# Altium schematic sheet USB-CONN.schdoc: TEBF0808 - USB Connectors
size A4; DocumentNumber: TEBF0808; Revision: 04; SheetNumber: 16; SheetTotal: 36; Date: 2016-09-29; CompanyName: Trenz Electronic GmbH; Organization: Trenz Electronic GmbH
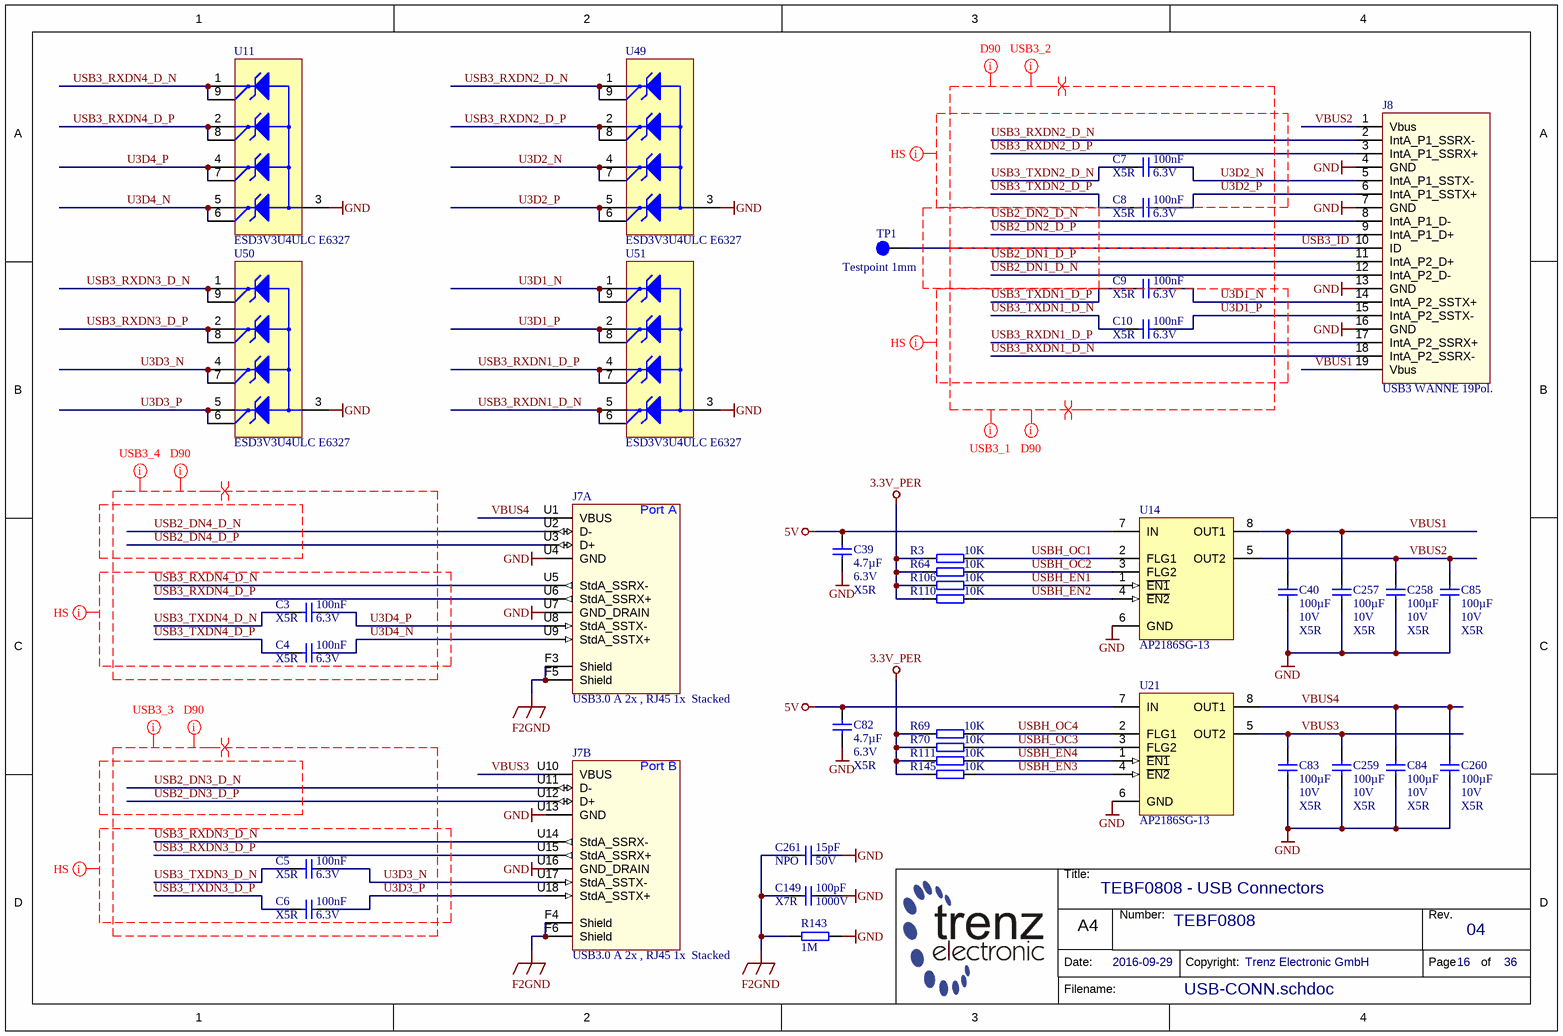
[diagram p0: USB-CONN.schdoc]

## Parts
C3  100nF  Voltage: 6.3V  Technology: X5R  [CAPC0603X33N]
C4  100nF  Voltage: 6.3V  Technology: X5R  [CAPC0603X33N]
C5  100nF  Voltage: 6.3V  Technology: X5R  [CAPC0603X33N]
C6  100nF  Voltage: 6.3V  Technology: X5R  [CAPC0603X33N]
C7  100nF  Voltage: 6.3V  Technology: X5R  [CAPC0603X33N]
C8  100nF  Voltage: 6.3V  Technology: X5R  [CAPC0603X33N]
C9  100nF  Voltage: 6.3V  Technology: X5R  [CAPC0603X33N]
C10  100nF  Voltage: 6.3V  Technology: X5R  [CAPC0603X33N]
C39  4.7µF  Voltage: 6.3V  Technology: X5R  [CAPC1005X60N]
C40  100µF  Voltage: 10V  Technology: X5R  [CAPC3216X180N]
C82  4.7µF  Voltage: 6.3V  Technology: X5R  [CAPC1005X60N]
C83  100µF  Voltage: 10V  Technology: X5R  [CAPC3216X180N]
C84  100µF  Voltage: 10V  Technology: X5R  [CAPC3216X180N]
C85  100µF  Voltage: 10V  Technology: X5R  [CAPC3216X180N]
C149  100pF  Voltage: X7R  Technology: 1000V  [CAPC3216X180N]
C257  100µF  Voltage: 10V  Technology: X5R  [CAPC3216X180N]
C258  100µF  Voltage: 10V  Technology: X5R  [CAPC3216X180N]
C259  100µF  Voltage: 10V  Technology: X5R  [CAPC3216X180N]
C260  100µF  Voltage: 10V  Technology: X5R  [CAPC3216X180N]
C261  15pF  Voltage: 50V  Technology: NPO  [CAPC1005X55N]
J7  USB3.0 A 2x , RJ45 1x  Stacked  [7497110616]  (parts A,B of 5)
J8  USB3 WANNE 19Pol.  [WANNE2mm2R-19_Intel_USB]
R3  10K  [RESC1005X40N]
R64  10K  [RESC1005X40N]
R69  10K  [RESC1005X40N]
R70  10K  [RESC1005X40N]
R106  10K  [RESC1005X40N]
R110  10K  [RESC1005X40N]
R111  10K  [RESC1005X40N]
R143  1M  [RESC3216X65N]
R145  10K  [RESC1005X40N]
TP1  Testpoint 1mm  [TP_1mm]
U11  ESD3V3U4ULC E6327  [TSLP-9-1]
U14  AP2186SG-13  [SOIC127P600X175-8N]
U21  AP2186SG-13  [SOIC127P600X175-8N]
U49  ESD3V3U4ULC E6327  [TSLP-9-1]
U50  ESD3V3U4ULC E6327  [TSLP-9-1]
U51  ESD3V3U4ULC E6327  [TSLP-9-1]

## Nets
3.3V_PER: R3.1 R64.1 R69.1 R70.1 R106.1 R110.1 R111.1 R145.1
5V: C39.1 C82.1 U14.7(IN) U21.7(IN)
F2GND: C149.1 C261.1 J7.F3(Shield) J7.F4(Shield) J7.F5(Shield) J7.F6(Shield) R143.1
GND: C39.2 C40.2 C82.2 C83.2 C84.2 C85.2 C149.2 C257.2 C258.2 C259.2 C260.2 C261.2 J7.U4(GND) J7.U7(GND_DRAIN) J7.U13(GND) J7.U16(GND_DRAIN) J8.4(GND) J8.7(GND) J8.13(GND) J8.16(GND) R143.2 U11.3 U14.6(GND) U21.6(GND) U49.3 U50.3 U51.3
U3D1_N: C9.2 J8.14(IntA_P2_SSTX+) U51.1 U51.9
U3D1_P: C10.2 J8.15(IntA_P2_SSTX-) U51.2 U51.8
U3D2_N: C7.2 J8.5(IntA_P1_SSTX-) U49.4 U49.7
U3D2_P: C8.2 J8.6(IntA_P1_SSTX+) U49.5 U49.6
U3D3_N: C5.2 J7.U17(StdA_SSTX-) U50.4 U50.7
U3D3_P: C6.2 J7.U18(StdA_SSTX+) U50.5 U50.6
U3D4_N: C4.2 J7.U9(StdA_SSTX+) U11.5 U11.6
U3D4_P: C3.2 J7.U8(StdA_SSTX-) U11.4 U11.7
USB2_DN1_D_N: J8.12(IntA_P2_D-)
USB2_DN1_D_P: J8.11(IntA_P2_D+)
USB2_DN2_D_N: J8.8(IntA_P1_D-)
USB2_DN2_D_P: J8.9(IntA_P1_D+)
USB2_DN3_D_N: J7.U11(D-)
USB2_DN3_D_P: J7.U12(D+)
USB2_DN4_D_N: J7.U2(D-)
USB2_DN4_D_P: J7.U3(D+)
USB3_ID: J8.10(ID) TP1.1
USB3_RXDN1_D_N: J8.18(IntA_P2_SSRX-) U51.5 U51.6
USB3_RXDN1_D_P: J8.17(IntA_P2_SSRX+) U51.4 U51.7
USB3_RXDN2_D_N: J8.2(IntA_P1_SSRX-) U49.1 U49.9
USB3_RXDN2_D_P: J8.3(IntA_P1_SSRX+) U49.2 U49.8
USB3_RXDN3_D_N: J7.U14(StdA_SSRX-) U50.1 U50.9
USB3_RXDN3_D_P: J7.U15(StdA_SSRX+) U50.2 U50.8
USB3_RXDN4_D_N: J7.U5(StdA_SSRX-) U11.1 U11.9
USB3_RXDN4_D_P: J7.U6(StdA_SSRX+) U11.2 U11.8
USB3_TXDN1_D_N: C10.1
USB3_TXDN1_D_P: C9.1
USB3_TXDN2_D_N: C7.1
USB3_TXDN2_D_P: C8.1
USB3_TXDN3_D_N: C5.1
USB3_TXDN3_D_P: C6.1
USB3_TXDN4_D_N: C3.1
USB3_TXDN4_D_P: C4.1
USBH_EN1: R106.2 U14.1(~{EN1})
USBH_EN2: R110.2 U14.4(~{EN2})
USBH_EN3: R145.2 U21.4(~{EN2})
USBH_EN4: R111.2 U21.1(~{EN1})
USBH_OC1: R3.2 U14.2(FLG1)
USBH_OC2: R64.2 U14.3(FLG2)
USBH_OC3: R70.2 U21.3(FLG2)
USBH_OC4: R69.2 U21.2(FLG1)
VBUS1: C40.1 C257.1 J8.19(Vbus) U14.8(OUT1)
VBUS2: C85.1 C258.1 J8.1(Vbus) U14.5(OUT2)
VBUS3: C83.1 C259.1 J7.U10(VBUS) U21.5(OUT2)
VBUS4: C84.1 C260.1 J7.U1(VBUS) U21.8(OUT1)

## Layout directives
net class USB3_3: U3D3_N, U3D3_P, USB2_DN3_D_N, USB2_DN3_D_P, USB3_RXDN3_D_N, USB3_RXDN3_D_P, USB3_TXDN3_D_N, USB3_TXDN3_D_P
net class USB3_4: U3D4_N, U3D4_P, USB2_DN4_D_N, USB2_DN4_D_P, USB3_RXDN4_D_N, USB3_RXDN4_D_P, USB3_TXDN4_D_N, USB3_TXDN4_D_P
differential pair: U3D1_N, U3D1_P, U3D2_N, U3D2_P, U3D3_N, U3D3_P, U3D4_N, U3D4_P, USB2_DN1_D_N, USB2_DN1_D_P, USB2_DN2_D_N, USB2_DN2_D_P, USB2_DN3_D_N, USB2_DN3_D_P, USB2_DN4_D_N, USB2_DN4_D_P, USB3_RXDN1_D_N, USB3_RXDN1_D_P, USB3_RXDN2_D_N, USB3_RXDN2_D_P, USB3_RXDN3_D_N, USB3_RXDN3_D_P, USB3_RXDN4_D_N, USB3_RXDN4_D_P, USB3_TXDN1_D_N, USB3_TXDN1_D_P, USB3_TXDN2_D_N, USB3_TXDN2_D_P, USB3_TXDN3_D_N, USB3_TXDN3_D_P, USB3_TXDN4_D_N, USB3_TXDN4_D_P
net class D90: U3D1_N, U3D1_P, U3D2_N, U3D2_P, U3D3_N, U3D3_P, U3D4_N, U3D4_P, USB2_DN1_D_N, USB2_DN1_D_P, USB2_DN2_D_N, USB2_DN2_D_P, USB2_DN3_D_N, USB2_DN3_D_P, USB2_DN4_D_N, USB2_DN4_D_P, USB3_RXDN1_D_N, USB3_RXDN1_D_P, USB3_RXDN2_D_N, USB3_RXDN2_D_P, USB3_RXDN3_D_N, USB3_RXDN3_D_P, USB3_RXDN4_D_N, USB3_RXDN4_D_P, USB3_TXDN1_D_N, USB3_TXDN1_D_P, USB3_TXDN2_D_N, USB3_TXDN2_D_P, USB3_TXDN3_D_N, USB3_TXDN3_D_P, USB3_TXDN4_D_N, USB3_TXDN4_D_P
net class HS: U3D1_N, U3D1_P, U3D2_N, U3D2_P, U3D3_N, U3D3_P, U3D4_N, U3D4_P, USB3_RXDN1_D_N, USB3_RXDN1_D_P, USB3_RXDN2_D_N, USB3_RXDN2_D_P, USB3_RXDN3_D_N, USB3_RXDN3_D_P, USB3_RXDN4_D_N, USB3_RXDN4_D_P, USB3_TXDN1_D_N, USB3_TXDN1_D_P, USB3_TXDN2_D_N, USB3_TXDN2_D_P, USB3_TXDN3_D_N, USB3_TXDN3_D_P, USB3_TXDN4_D_N, USB3_TXDN4_D_P
net class USB3_1: U3D1_N, U3D1_P, USB2_DN1_D_N, USB2_DN1_D_P, USB3_RXDN1_D_N, USB3_RXDN1_D_P, USB3_TXDN1_D_N, USB3_TXDN1_D_P
net class USB3_2: U3D2_N, U3D2_P, USB2_DN2_D_N, USB2_DN2_D_P, USB3_RXDN2_D_N, USB3_RXDN2_D_P, USB3_TXDN2_D_N, USB3_TXDN2_D_P

## Notes on the sheet
- Title:
- Number:
- Rev.
- Date:
- A4
- Copyright:
- Page
- of
- Filename:
- (in symbol 27271, part A) Port A
- (in symbol 27271, part B) Port B

## Library data of the parts
C3-C10 = 24915: KON 100nF 6.3V X5R SMD 10%; AN: 24915; Mixed: SMT; Value: 100n; Preferred: Yes; Case: 0603 (0201); Tolerance: 10%
C39 C82 = 24719: KON 4.7µF 6.3V X5R SMD 20%; AN: 24719; Mixed: SMT; Value: 4.7u; Preferred: Yes; Case: 1005 (0402); Tolerance: 20%
C40 C83-C85 C257-C260 = 26278: KON 100µF 10V X5R SMD 20%; AN: 26278; Mixed: SMT; Value: 100u; Preferred: Yes; Case: 3216 (1206); Tolerance: 20%
C149 = 22679: KON 100pF 1000V X7R 10%; AN: 22679; Value: 100p; Preferred: Yes; Mixed: SMT; Case: 3216 (1206); Tolerance: 10%
C261 = 23951: KON 15pF NPO 50V SMD; AN: 23951; Value: 15p; Mixed: SMT; Preferred: Yes; Case: 1005 (0402)
J7 = 27271: AN: 27271; Mixed: THT; Trenz-Stock: Yes; HelpURL: B:\AD\adlib\datasheet\7497110616; H-ART: 7497110616
J8 = 27248: Stiftleiste USB3 Wanne 19polig 0°; AN: 27248; Mixed: THT; Trenz-Stock: Yes; HelpURL: B:\AD\adlib\datasheet\INTEL_USB3_0
R3 R64 R69 R70 R106 R110 R111 R145 = 22750: WID SMD 10K 1% 0,063W; AN: 22750; Mixed: SMT; Preferred: Yes; Tolerance: 1%; Case: 1005 (0402); Technology: TK100; Value: 10K
R143 = 22757: WID SMD 1M 5% 0,25W; AN: 22757; Mixed: SMT; Preferred: Yes; Case: 3216 (1206); Value: 1M; Tolerance: 5%; Technology: TK100
TP1 = 25063: AN: 25063; Mixed: SMT
U11 U49-U51 = 25369: TVS UL Cap. 4xIOs ESD 3.3V; AN: 25369; Mixed: SMT; Case: TSLP-9-1; HelpURL: B:\AD\adlib\datasheet\ESD3V3U4ULC; H-ART: ESD3V3U4ULC E6327
U14 U21 = 27612: AN: 27612; Mixed: SMT; Case: SO8; HelpURL: b:\AD\adlib\datasheet\AP21x6\; H-ART: AP2186SG-13